# Altium schematic sheet ui_front.SchDoc: mcHF Pro Transceiver UI board
size A3; Author: Krassi Atanassov; CompanyName: MØNKA; Engineer: For radio amateurs experimentation, non-commercial use only. Thank you!; Revision: 0.8.5; SheetTotal: 13
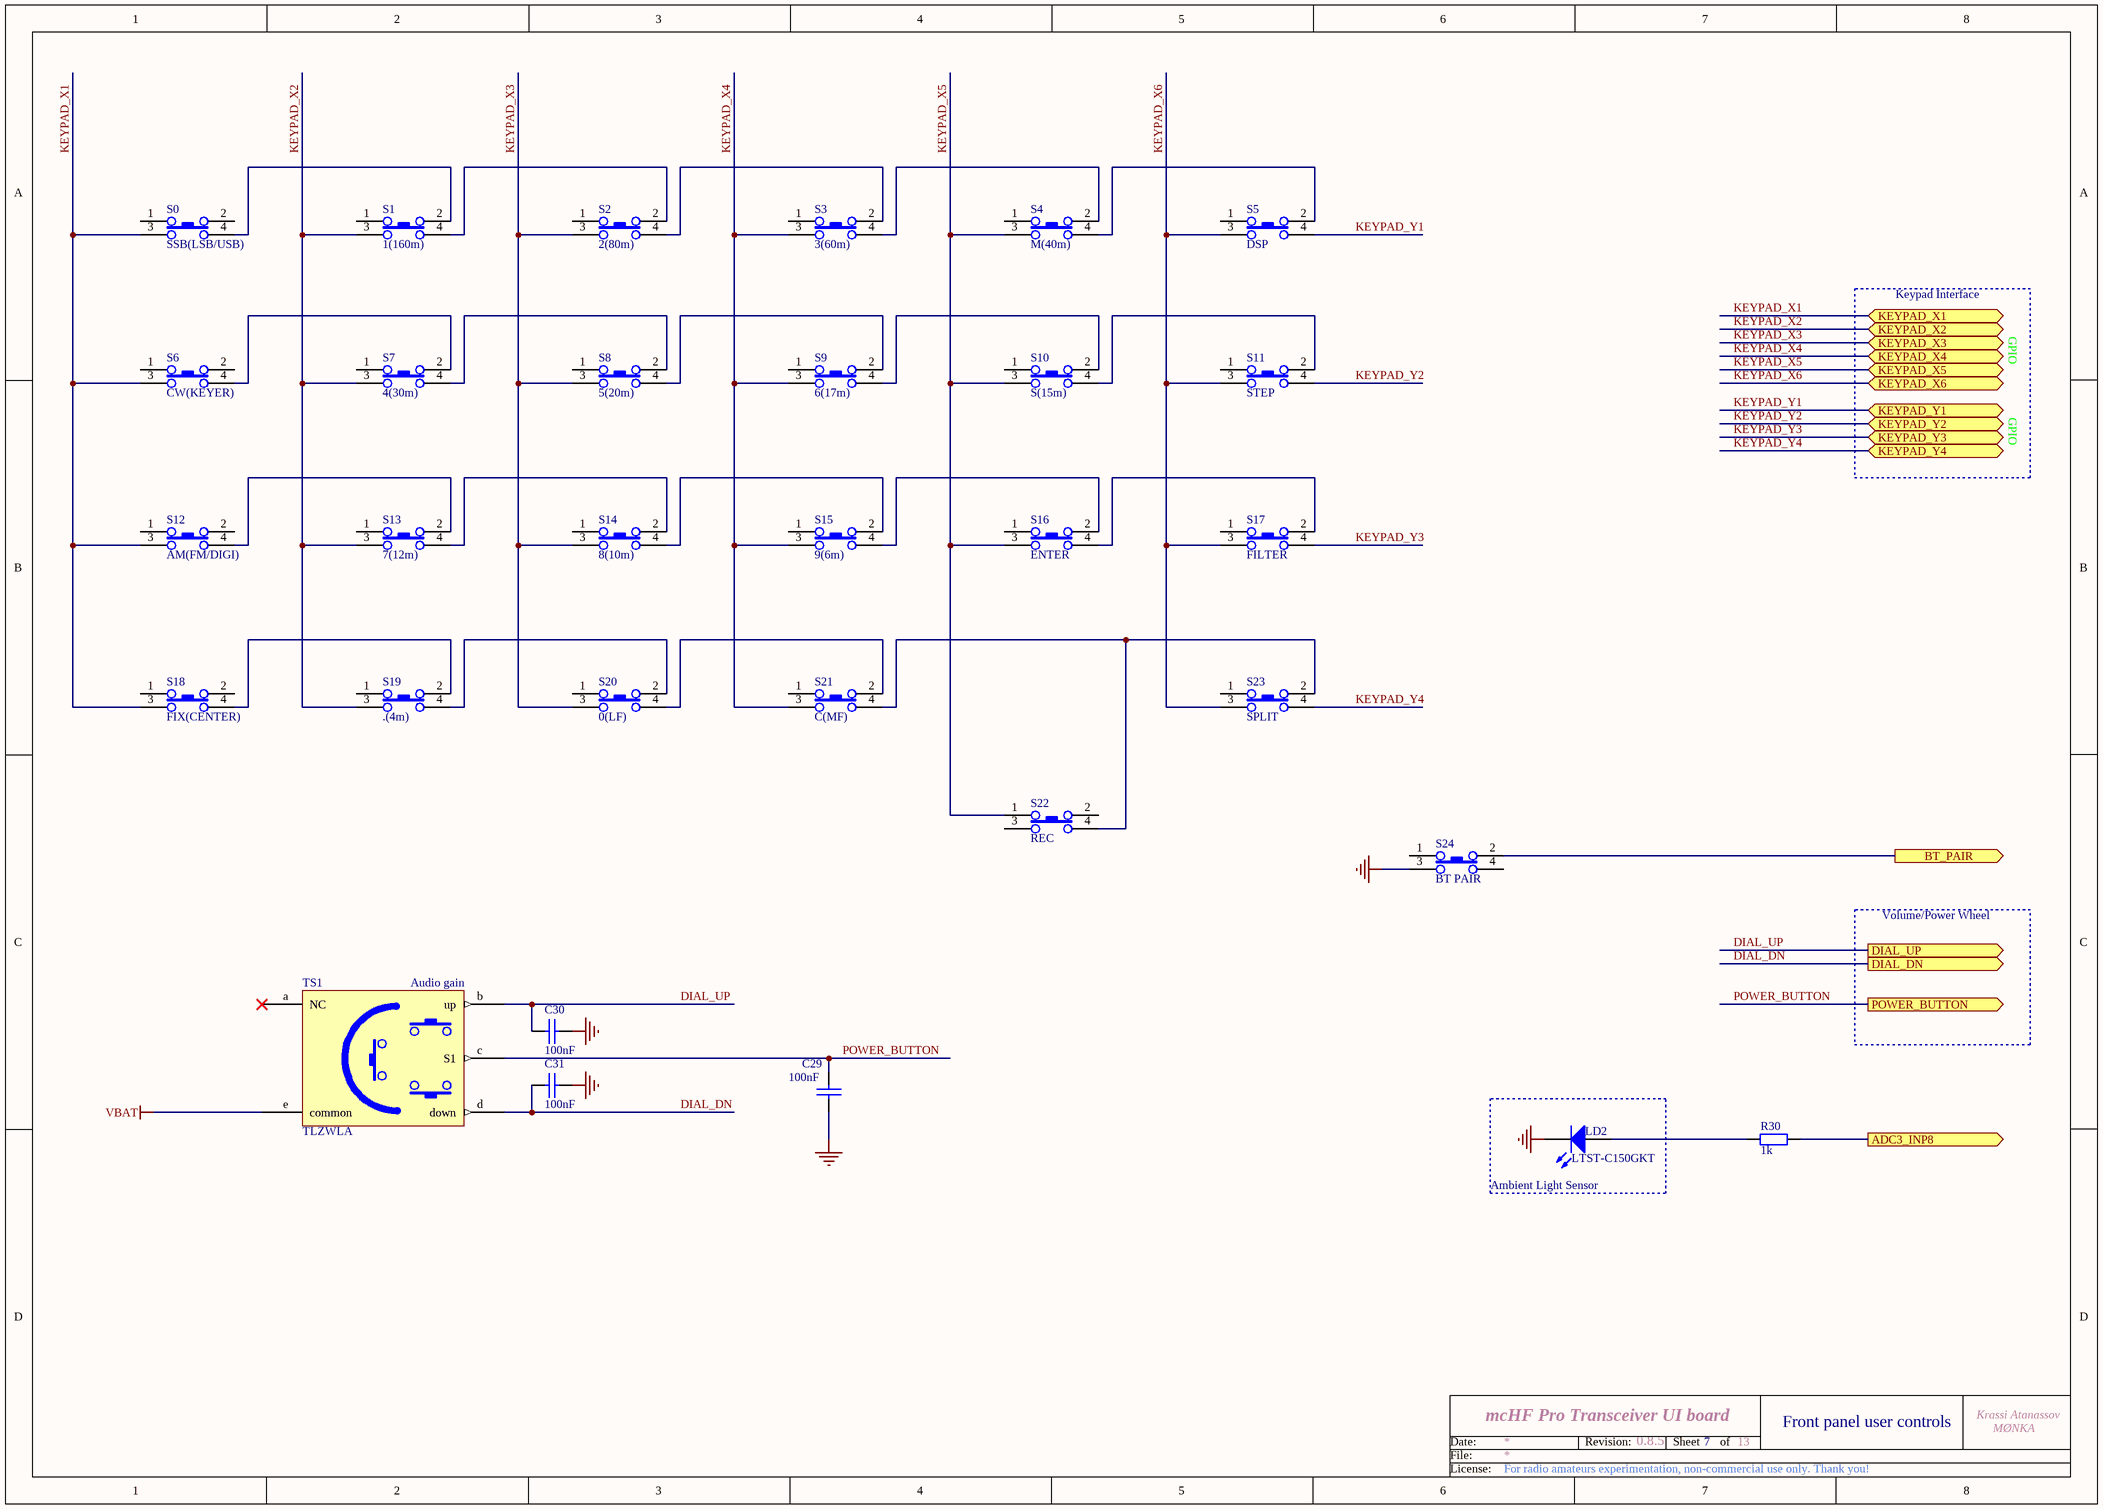
[diagram p0: ui_front.SchDoc]

## Parts
C29  100nF  [0805]
C30  100nF  [0805]
C31  100nF  [0805]
LD2  LTST-C150GKT  [1206_Elec_Cap]  (no BOM)
R30  1k  [0805]
S0  SSB(LSB/USB)  [BUTTON_SMD2]  (no BOM)
S1  1(160m)  [BUTTON_SMD2]  (no BOM)
S2  2(80m)  [BUTTON_SMD2]  (no BOM)
S3  3(60m)  [BUTTON_SMD2]  (no BOM)
S4  M(40m)  [BUTTON_SMD2]  (no BOM)
S5  DSP  [BUTTON_SMD2]  (no BOM)
S6  CW(KEYER)  [BUTTON_SMD2]  (no BOM)
S7  4(30m)  [BUTTON_SMD2]  (no BOM)
S8  5(20m)  [BUTTON_SMD2]  (no BOM)
S9  6(17m)  [BUTTON_SMD2]  (no BOM)
S10  S(15m)  [BUTTON_SMD2]  (no BOM)
S11  STEP  [BUTTON_SMD2]  (no BOM)
S12  AM(FM/DIGI)  [BUTTON_SMD2]  (no BOM)
S13  7(12m)  [BUTTON_SMD2]  (no BOM)
S14  8(10m)  [BUTTON_SMD2]  (no BOM)
S15  9(6m)  [BUTTON_SMD2]  (no BOM)
S16  ENTER  [BUTTON_SMD2]  (no BOM)
S17  FILTER  [BUTTON_SMD2]  (no BOM)
S18  FIX(CENTER)  [BUTTON_SMD2]  (no BOM)
S19  .(4m)  [BUTTON_SMD2]  (no BOM)
S20  0(LF)  [BUTTON_SMD2]  (no BOM)
S21  C(MF)  [BUTTON_SMD2]  (no BOM)
S22  REC  [BUTTON_SMD3]
S23  SPLIT  [BUTTON_SMD2]  (no BOM)
S24  BT PAIR  [BUTTON_SMD3]
TS1  TLZWLA  [TLZWLA]

## Blocks framed on the sheet
Ambient Light Sensor: LD2

## Ports
ADC3_INP8 (out), BT_PAIR (out), DIAL_DN (out), DIAL_UP (out), KEYPAD_X1 (bidir), KEYPAD_X2 (bidir), KEYPAD_X3 (bidir), KEYPAD_X4 (bidir), KEYPAD_X5 (bidir), KEYPAD_X6 (bidir), KEYPAD_Y1 (bidir), KEYPAD_Y2 (bidir), KEYPAD_Y3 (bidir), KEYPAD_Y4 (bidir), POWER_BUTTON (out)

## Nets
GND: C29.1 C30.2 C31.2 LD2.2(K) S24.3
VBAT: TS1.e(common)
ADC3_INP8: R30.1 ; port ADC3_INP8
BT_PAIR: S24.2 ; port BT_PAIR
DIAL_DN: C31.1 TS1.d(down) ; port DIAL_DN
DIAL_UP: C30.1 TS1.b(up) ; port DIAL_UP
KEYPAD_X1: S0.3 S6.3 S12.3 S18.3 ; port KEYPAD_X1
KEYPAD_X2: S1.3 S7.3 S13.3 S19.3 ; port KEYPAD_X2
KEYPAD_X3: S2.3 S8.3 S14.3 S20.3 ; port KEYPAD_X3
KEYPAD_X4: S3.3 S9.3 S15.3 S21.3 ; port KEYPAD_X4
KEYPAD_X5: S4.3 S10.3 S16.3 S22.1 ; port KEYPAD_X5
KEYPAD_X6: S5.3 S11.3 S17.3 S23.3 ; port KEYPAD_X6
KEYPAD_Y1: S5.4 ; port KEYPAD_Y1
KEYPAD_Y2: S11.4 ; port KEYPAD_Y2
KEYPAD_Y3: S17.4 ; port KEYPAD_Y3
KEYPAD_Y4: S23.4 ; port KEYPAD_Y4
POWER_BUTTON: C29.2 TS1.c(S1) ; port POWER_BUTTON
NetLD2_1: LD2.1(A) R30.2
NetS0_4: S0.4 S1.2
NetS1_4: S1.4 S2.2
NetS2_4: S2.4 S3.2
NetS3_4: S3.4 S4.2
NetS4_4: S4.4 S5.2
NetS6_4: S6.4 S7.2
NetS7_4: S7.4 S8.2
NetS8_4: S8.4 S9.2
NetS9_4: S9.4 S10.2
NetS10_4: S10.4 S11.2
NetS12_4: S12.4 S13.2
NetS13_4: S13.4 S14.2
NetS14_4: S14.4 S15.2
NetS15_4: S15.4 S16.2
NetS16_4: S16.4 S17.2
NetS18_4: S18.4 S19.2
NetS19_4: S19.4 S20.2
NetS20_4: S20.4 S21.2
NetS21_4: S21.4 S22.4 S23.2

Not connected (* = marked no-connect by the designer): S0 1 2; S1 1; S2 1; S3 1; S4 1; S5 1; S6 1 2; S7 1; S8 1; S9 1; S10 1; S11 1; S12 1 2; S13 1; S14 1; S15 1; S16 1; S17 1; S18 1 2; S19 1; S20 1; S21 1; S22 2 3; S23 1; S24 1 4; TS1 a(NC)*

## Notes on the sheet
- Keypad Interface
- GPIO
- Volume/Power Wheel
- (near TS1) Audio gain
- 7
- Front panel user controls
- Date:
- File:
- Revision:
- Sheet
- of
- License:

## Library data of the parts
C29 = CAP: Capacitor; Order: FN 282-1264; QT Order: QCC-00157; Price: 0.089
C30 = CAP: Capacitor; Order: FN 190-7054; QT Order: QCC-00259; QT Price: 0.05; Price: 0.038
C31 = CAP: Capacitor; Order: FN 190-7054; QT Order: QCC-00259; Price: 0.038
LD2 = LED2: LED 3mm; QT Order: QCD-00052; Revision: July-2002: Re-released for DXP Platform.; Price: 0.116
R30 = RES: Resistor; Order: FN 146-9899; QT Order: QCR-00309; Price: 0.023
S0-S21 S23 = SW-PB: Push Button
S22 S24 = SW-PBS: Push Side Button
TS1 = TLZWLA: Thumbwheel Toggle Switch; Order: FN 206-4978